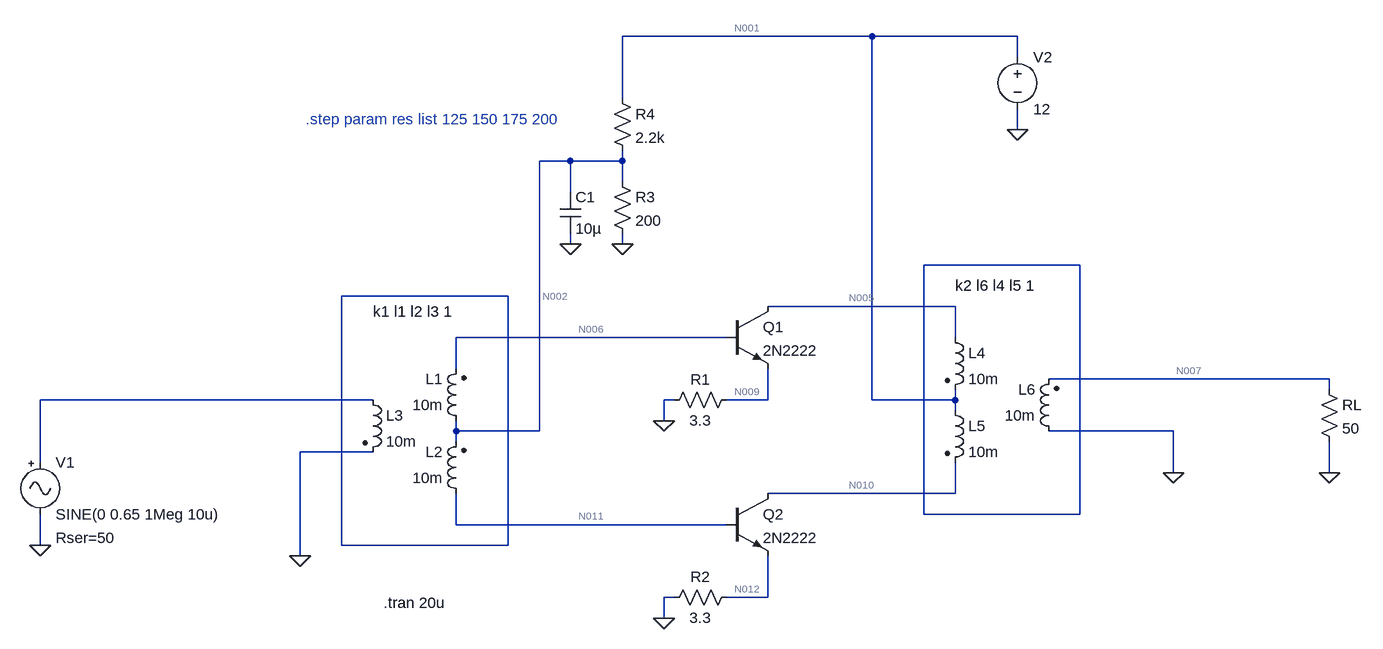
[diagram p0: schematic 10W QRP Amplifier class B.asc]
10W QRP Amplifier class B.asc, the LTspice schematic file:
Version 4
SHEET 1 1144 680
WIRE 384 -400 0 -400
WIRE 608 -400 384 -400
WIRE 608 -368 608 -400
WIRE 0 -304 0 -400
WIRE 608 -256 608 -288
WIRE -80 -208 -128 -208
WIRE 0 -208 0 -224
WIRE 0 -208 -80 -208
WIRE 0 -176 0 -208
WIRE -80 -160 -80 -208
WIRE -80 -80 -80 -96
WIRE 0 -80 0 -96
WIRE 704 -48 464 -48
WIRE -176 0 -432 0
WIRE 512 16 224 16
WIRE 160 64 -256 64
WIRE 512 64 512 16
WIRE -256 112 -256 64
WIRE 1088 128 656 128
WIRE 1088 144 1088 128
WIRE -384 160 -896 160
WIRE 80 160 64 160
WIRE 224 160 224 112
WIRE 224 160 160 160
WIRE 384 160 384 -400
WIRE 512 160 512 144
WIRE 512 160 384 160
WIRE 512 176 512 160
WIRE 64 192 64 160
WIRE -256 208 -256 192
WIRE -128 208 -128 -208
WIRE -128 208 -256 208
WIRE 848 208 656 208
WIRE -256 224 -256 208
WIRE -384 240 -496 240
WIRE -896 256 -896 160
WIRE 848 272 848 208
WIRE 1088 272 1088 224
WIRE 512 304 512 256
WIRE 512 304 224 304
WIRE 464 336 464 -48
WIRE 704 336 704 -48
WIRE 704 336 464 336
WIRE -256 352 -256 304
WIRE 160 352 -256 352
WIRE -896 384 -896 336
WIRE -432 384 -432 0
WIRE -176 384 -176 0
WIRE -176 384 -432 384
WIRE -496 400 -496 240
WIRE 80 464 64 464
WIRE 224 464 224 400
WIRE 224 464 160 464
WIRE 64 496 64 464
FLAG 64 192 0
FLAG 64 496 0
FLAG -496 400 0
FLAG -896 384 0
FLAG -80 -80 0
FLAG 0 -80 0
FLAG 848 272 0
FLAG 1088 272 0
FLAG 608 -256 0
SYMBOL npn 160 16 R0
SYMATTR InstName Q1
SYMATTR Value 2N2222
SYMBOL npn 160 304 R0
SYMATTR InstName Q2
SYMATTR Value 2N2222
SYMBOL res 176 144 R90
WINDOW 0 0 56 VBottom 2
WINDOW 3 32 56 VTop 2
SYMATTR InstName R1
SYMATTR Value 3.3
SYMBOL res 176 448 R90
WINDOW 0 0 56 VBottom 2
WINDOW 3 32 56 VTop 2
SYMATTR InstName R2
SYMATTR Value 3.3
SYMBOL ind2 -240 208 R180
WINDOW 0 36 80 Left 2
WINDOW 3 36 40 Left 2
SYMATTR InstName L1
SYMATTR Value 10m
SYMATTR Type ind
SYMBOL ind2 -240 320 R180
WINDOW 0 36 80 Left 2
WINDOW 3 36 40 Left 2
SYMATTR InstName L2
SYMATTR Value 10m
SYMATTR Type ind
SYMBOL ind2 -400 144 R0
SYMATTR InstName L3
SYMATTR Value 10m
SYMATTR Type ind
SYMBOL Misc\\signal -896 240 R0
WINDOW 123 0 0 Left 0
WINDOW 39 24 132 Left 2
SYMATTR InstName V1
SYMATTR Value SINE(0 0.65 1Meg 10u)
SYMATTR SpiceLine Rser=50
SYMBOL cap -96 -160 R0
SYMATTR InstName C1
SYMATTR Value 10µ
SYMBOL res -16 -192 R0
SYMATTR InstName R3
SYMATTR Value 200
SYMBOL res -16 -320 R0
SYMATTR InstName R4
SYMATTR Value 2.2k
SYMBOL ind2 496 48 R0
SYMATTR InstName L4
SYMATTR Value 10m
SYMATTR Type ind
SYMBOL ind2 496 160 R0
SYMATTR InstName L5
SYMATTR Value 10m
SYMATTR Type ind
SYMBOL ind2 672 224 R180
WINDOW 0 36 80 Left 2
WINDOW 3 36 40 Left 2
SYMATTR InstName L6
SYMATTR Value 10m
SYMATTR Type ind
SYMBOL res 1072 128 R0
SYMATTR InstName RL
SYMATTR Value 50
SYMBOL voltage 608 -384 R0
WINDOW 123 0 0 Left 0
WINDOW 39 0 0 Left 0
SYMATTR InstName V2
SYMATTR Value 12
TEXT -384 24 Left 2 !k1 l1 l2 l3 1
TEXT 512 -16 Left 2 !k2 l6 l4 l5 1
TEXT -368 472 Left 2 !.tran 20u
TEXT -488 -272 Left 2 ;.step param res list 125 150 175 200

The netlist it stands for:
* 10W QRP Amplifier class B.asc
Q1 N005 N006 N009 0 2N2222
Q2 N010 N011 N012 0 2N2222
R1 N009 0 3.3
R2 N012 0 3.3
L1 N002 N006 10m
L2 N011 N002 10m
L3 N008 0 10m
V1 N008 0 SINE(0 0.65 1Meg 10u) Rser=50
C1 N002 0 10µ
R3 N002 0 200
R4 N001 N002 2.2k
L4 N005 N001 10m
L5 N001 N010 10m
L6 0 N007 10m
RL N007 0 50
V2 N001 0 12
.model NPN NPN
.model PNP PNP
.lib standard.bjt
k1 l1 l2 l3 1
k2 l6 l4 l5 1
.tran 20u
* .step param res list 125 150 175 200
.backanno
.end

* Results of the author's LTspice run, read from the files saved beside the schematic
* Operating Point, zero values left out:
*   V(n005) = 12 V
*   V(n006) = 915.4 mV
*   V(n009) = 149.8 mV
*   V(n010) = 12 V
*   V(n011) = 915.4 mV
*   V(n012) = 149.8 mV
*   V(n002) = 915.4 mV
*   V(n001) = 12 V
*   Ic(Q1) = 45.15 mA
*   Ib(Q1) = 230.8 µA
*   Ie(Q1) = -45.38 mA
*   Ic(Q2) = 45.15 mA
*   Ib(Q2) = 230.8 µA
*   Ie(Q2) = -45.38 mA
*   I(L1) = 230.8 µA
*   I(L2) = -230.8 µA
*   I(L4) = -45.15 mA
*   I(L5) = 45.15 mA
*   I(R1) = 45.38 mA
*   I(R2) = 45.38 mA
*   I(R3) = 4.577 mA
*   I(R4) = 5.038 mA
*   I(V2) = -95.34 mA
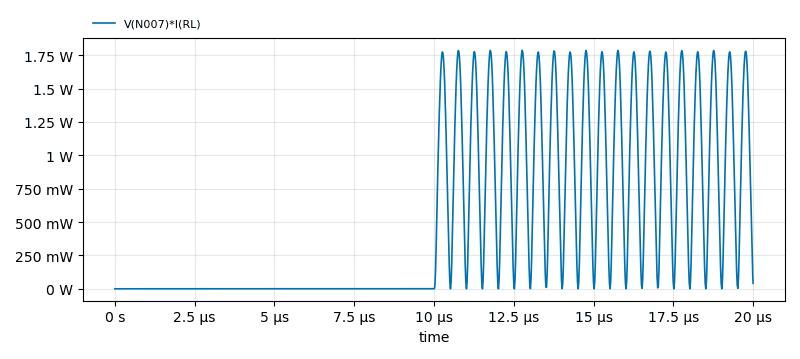
[diagram p1: Transient Analysis of 10W QRP Amplifier class B.asc, plotted from the saved traces]
* Transient Analysis, 1 run:
*   V(N007)*I(RL): min 0 W, max 1.786 W, average 496.2 mW, rms 823.2 mW, last 41.14 mW